# Altium schematic sheet Block.SchDoc
size A4; Organization: Altium Limited; Address1: L3, 12a Rodborough Rd; Address2: Frenchs Forest; Address3: NSW; Address4: Australia 2086
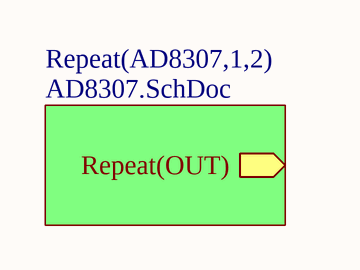
[diagram p0: Block.SchDoc]

## Sub-sheets
Repeat(AD8307,1,2) = AD8307.SchDoc: Repeat(OUT) (out)

## Notes on the sheet
- Projeto:
- Tamanho:
- Data:
- A4
- Eng. Felipe Navarro
- Hora:
- Revisão:
- Folha
- de
- Arquivo: